# EAGLE design LTSN (EAGLE 9.6.2)
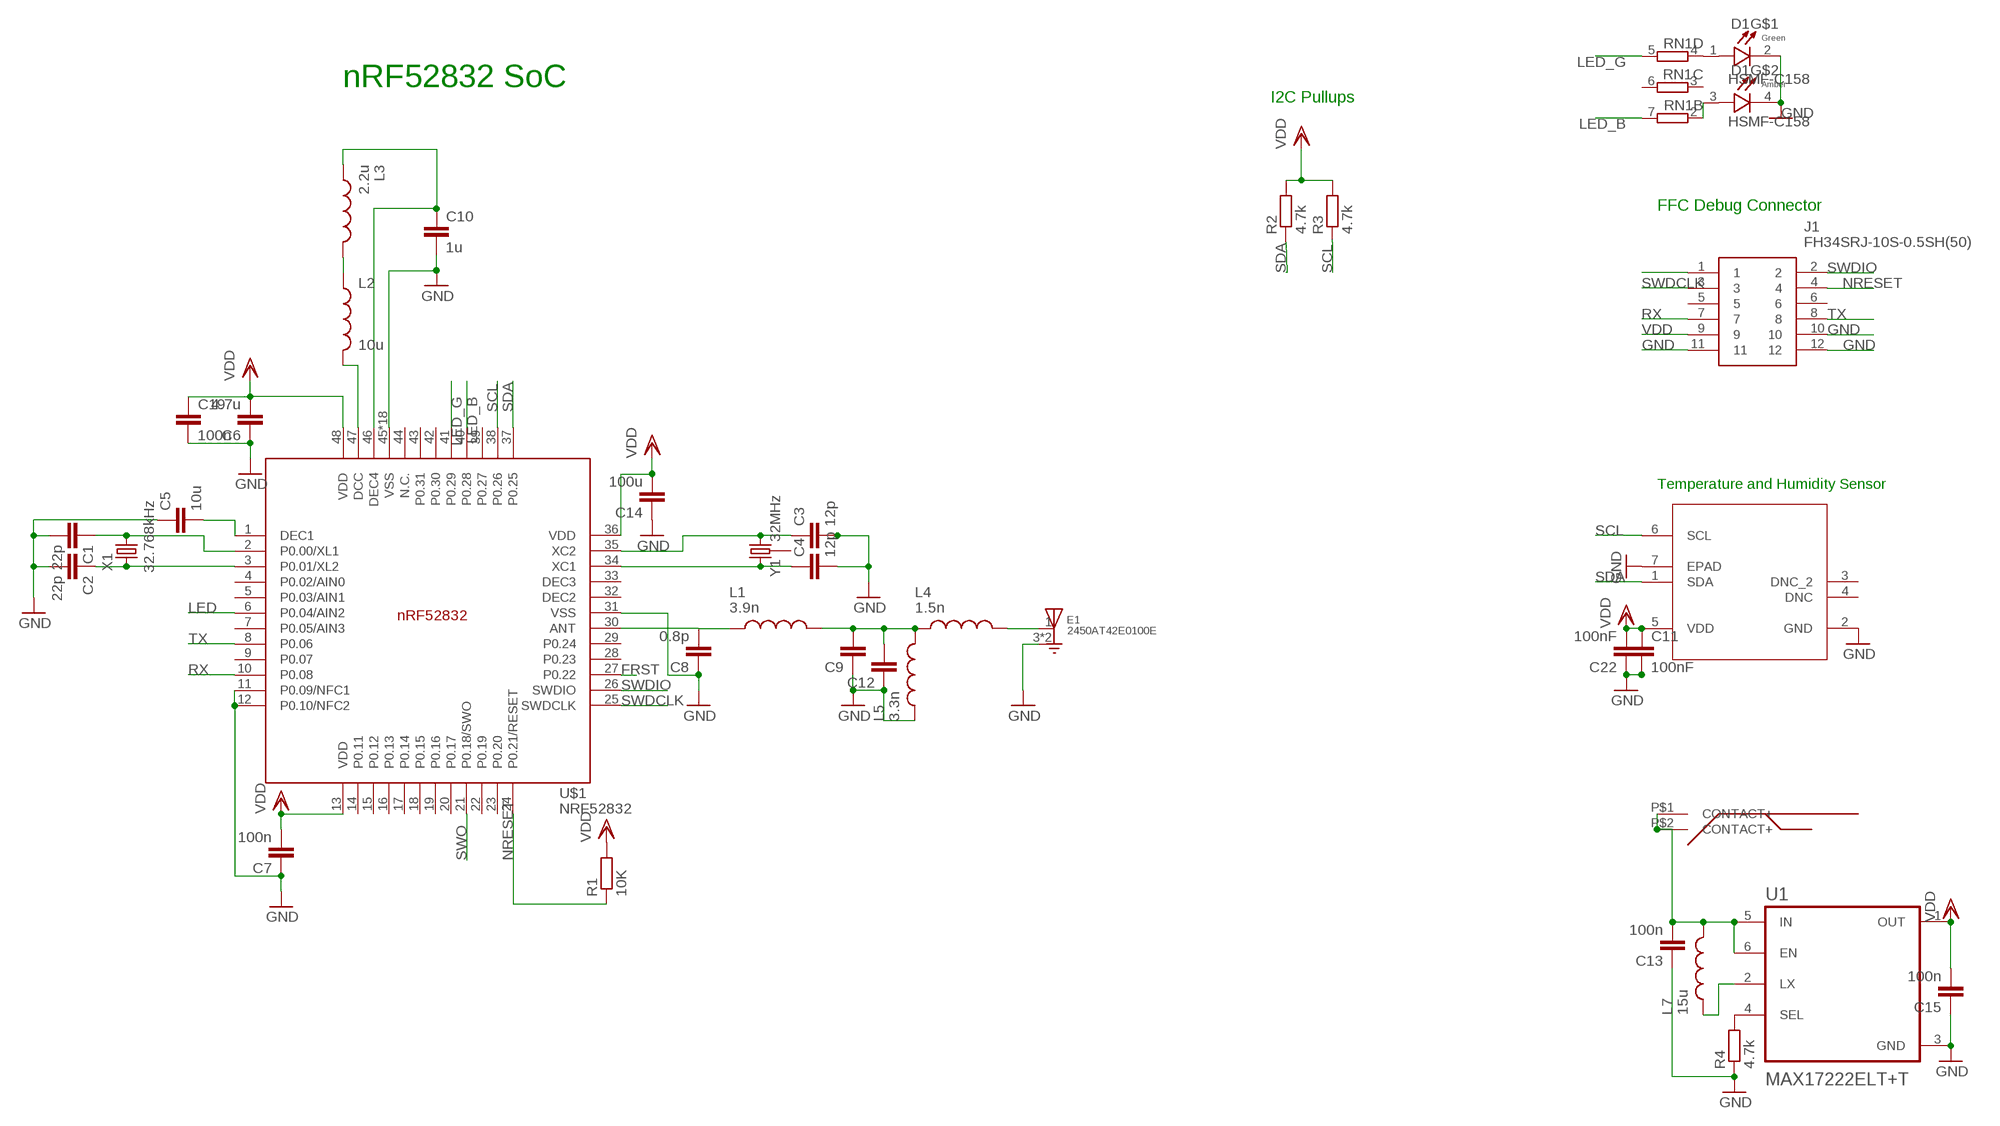
[diagram p0: schematic, sheet 1]

## Parts
C1  22p  CC0402  [C0402]
C2  22p  CC0402  [C0402]
C3  12p  CC0402  [C0402]
C4  12p  CC0402  [C0402]
C5  10u  CC0402  [C0402]
C6  4.7u  CC0402  [C0402]
C7  100n  CC0603R  [C0603R]
C8  0.8p  CC0402  [C0402]
C9  1.2p  CC0402  [C0402]
C10  1u  CC0402  [C0402]
C11  100nF  CC0402  [C0402]
C12  2p  CC0402  [C0402]
C13  100n  CC0603R  [C0603R]
C14  100u  CC0402  [C0402]
C15  100n  CC0603R  [C0603R]
C19  100n  CC0402  [C0402]
C22  100nF  CC0402  [C0402]
D1  HSMF-C158  [LED_HSMF-C158]
E1  2450AT42E0100E  [XDCR_2450AT42E0100E]
J1  FH34SRJ-10S-0.5SH(50)  [FH34SRJ10S05SH50]
L1  3.9n  MHQ0402P7N5JT000  [INDC0402X26N]
L2  10u  INDUCTOR  [L0603]
L3  2.2u  MHQ0402P7N5JT000  [INDC0402X26N]
L4  1.5n  MHQ0402P7N5JT000  [INDC0402X26N]
L5  3.3n  MHQ0402P7N5JT000  [INDC0402X26N]
L7  15u  1277AS-H-1R5M=P2  [INDC3225X120N]
R1  10K  RR0402  [R0402]
R2  4.7k  RR0402  [R0402]
R3  4.7k  RR0402  [R0402]
R4  4.7k  RR0402  [R0402]
RN1  4R-N0402ARV341  [4X0402ARV341]
U1  MAX17222ELT+T  [SON65P200X200X80-6N]
U10  SI7021-A20-GM1RDFN6_3X3_SIL-L  [DFN6_3X3_SIL-L]
U$1  NRF52832  [QFN40P600X600X90-48_N]
U$3  CR2032-THT  [CR2032-THT]
X1  32.768kHz  ABS07-32.768KHZ-T  [ABS07-32.768KHZ-T]
Y1  32MHz  CRYSTAL-26MHZSMD-3.2X2.5  [CRYSTAL-SMD-3.2X2.5MM]

## Nets
FRST: U$1.27(P0.22)
GND: C1.2 C2.2 C3.2 C4.2 C5.1 C6.1 C7.1 C8.1 C9.1 C10.2 C11.2 C12.1 C13.1 C14.1 C15.1 C19.2 C22.1 D1.2(C1) D1.4(C2) E1.3(GND) E1.4(GND) J1.10 J1.11 J1.12 L5.1 R4.1 U1.3(GND) U10.2(GND) U10.7(EPAD) U$1.11(P0.09/NFC1) U$1.12(P0.10/NFC2) U$1.31(VSS) U$1.45(VSS) U$1.PAD(VSS) U$1.PAD@VIA01(VSS) U$1.PAD@VIA02(VSS) U$1.PAD@VIA03(VSS) U$1.PAD@VIA04(VSS) U$1.PAD@VIA05(VSS) U$1.PAD@VIA06(VSS) U$1.PAD@VIA07(VSS) U$1.PAD@VIA08(VSS) U$1.PAD@VIA09(VSS) U$1.PAD@VIA10(VSS) U$1.PAD@VIA11(VSS) U$1.PAD@VIA12(VSS) U$1.PAD@VIA13(VSS) U$1.PAD@VIA14(VSS) U$1.PAD@VIA15(VSS) U$1.PAD@VIA16(VSS)
LED: U$1.6(P0.04/AIN2)
LED_B: RN1.7 U$1.40(P0.28)
LED_G: RN1.5 U$1.41(P0.29)
N$1: C1.1 U$1.2(P0.00/XL1) X1.2
N$2: C2.1 U$1.3(P0.01/XL2) X1.1
N$3: C3.1 U$1.35(XC2) Y1.3
N$4: C4.1 U$1.34(XC1) Y1.1
N$5: C5.2 U$1.1(DEC1)
N$6: C8.2 L1.1 U$1.30(ANT)
N$7: D1.1(A1) RN1.4
N$8: D1.3(A2) RN1.2
N$9: L2.2 U$1.47(DCC)
N$10: L2.1 L3.2
N$11: C10.1 L3.1 U$1.46(DEC4)
N$12: R4.2 U1.4(SEL)
N$13: E1.1(FEEDING) L4.2
N$15: C13.2 L7.2 U1.5(IN) U1.6(EN) U$3.P$1(CONTACT+) U$3.P$2(CONTACT+)
N$16: L7.1 U1.2(LX)
N$17: J1.1
NRESET: J1.4 R1.1 U$1.24(P0.21/RESET)
RF: C9.2 C12.2 L1.2 L4.1 L5.2
RX: J1.7 U$1.10(P0.08)
SCL: R3.1 U10.6(SCL) U$1.38(P0.26)
SDA: R2.1 U10.1(SDA) U$1.37(P0.25)
SWDCLK: J1.3 U$1.25(SWDCLK)
SWDIO: J1.2 U$1.26(SWDIO)
SWO: U$1.21(P0.18/SWO)
TX: J1.8 U$1.8(P0.06)
VDD: C6.2 C7.2 C11.1 C14.2 C15.2 C19.1 C22.2 J1.9 R1.2 R2.2 R3.2 U1.1(OUT) U10.5(VDD) U$1.13(VDD) U$1.36(VDD) U$1.48(VDD)
Unconnected: J1.5 J1.6 RN1.1 RN1.3 RN1.6 RN1.8 U10.3(DNC_2) U10.4(DNC) U$1.4(P0.02/AIN0) U$1.5(P0.03/AIN1) U$1.7(P0.05/AIN3) U$1.9(P0.07) U$1.14(P0.11) U$1.15(P0.12) U$1.16(P0.13) U$1.17(P0.14) U$1.18(P0.15) U$1.19(P0.16) U$1.20(P0.17) U$1.22(P0.19) U$1.23(P0.20) U$1.28(P0.23) U$1.29(P0.24) U$1.32(DEC2) U$1.33(DEC3) U$1.39(P0.27) U$1.42(P0.30) U$1.43(P0.31) U$1.44(N.C.) Y1.2 Y1.4

## Notes on the sheet
- nRF52832 SoC
- I2C Pullups
- FFC Debug Connector
- Temperature and Humidity Sensor

## Library data of the parts
C1-C6 C8-C12 C14 C19 C22 = eagle-ltspice:C: CAPACITOR, European symbol; SPICEMODEL: NONE; SPICEPREFIX: C
C7 C13 C15 = eagle-ltspice:C: CAPACITOR, European symbol
D1 = HSMF-C158:HSMF-C158: Amber, Green 592nm Amber, 572nm Green LED Indication - Discrete 1.9V Amber, 2.1V Green 1210 (3225 Metric) Check prices <https://pricing.snapeda.com/parts/HSMF-C158/Broadcom/view-part?ref=eda>; AVAILABILITY: In Stock; DESCRIPTION: Amber, Green 592nm Amber, 572nm Green LED Indication - Discrete 1.9V Amber, 2.1V Green 1210 (3225 Metric); MF: Broadcom; MP: HSMF-C158; PACKAGE: HSMF-C15 Broadcom; PRICE: None; PURCHASE-URL: https://pricing.snapeda.com/search/part/HSMF-C158/?ref=eda
E1 = 2450AT42E0100E:2450AT42E0100E: 2.4GHz Bluetooth, WLAN, Zigbee™ Chip RF Antenna 2.4GHz ~ 2.48GHz -2dBi Solder Surface Mount Check prices <https://pricing.snapeda.com/parts/2450AT42E0100E/Johanson%20Technology/view-part?ref=eda>; AVAILABILITY: In Stock; DESCRIPTION: 2.4GHz Bluetooth, WLAN, Zigbee™ Chip RF Antenna 2.4GHz ~ 2.48GHz -2dBi Solder Surface Mount; MF: Johanson Technology; MP: 2450AT42E0100E; PACKAGE: FBGA-780 Johanson Technology; PRICE: None; PURCHASE-URL: https://pricing.snapeda.com/search/part/2450AT42E0100E/?ref=eda
J1 = FH34SRJ-10S-0.5SH_50_:FH34SRJ-10S-0.5SH(50): HIROSE(HRS) - FH34SRJ-10S-0.5SH(50) - CONNECTOR, FFC/FPC, RCPT, 10POS, 1ROW Source: Datasheet <https://www.hirose.com/product/en/products/FH34SRJ/FH34SRJ-10S-0.5SH(50)/> Check prices <https://pricing.snapeda.com/search/part/FH34SRJ-10S-0.5SH%2850%29/?ref=eda>; AVAILABILITY: Good; DESCRIPTION: FFC & FPC Connectors 10POS 0.50MM R/A CONN FFC FPC; MF: Hirose Connector; MP: FH34SRJ-10S-0.5SH(50); PACKAGE: None; PRICE: None; PURCHASE-URL: https://pricing.snapeda.com/search/part/FH34SRJ-10S-0.5SH(50)/?ref=eda
L1 L3-L5 = MHQ0402P7N5JT000:MHQ0402P7N5JT000: 221 NH 5% GOLD TERMINAL; AVAILABILITY: Unavailable; DESCRIPTION: FIXED IND 7.5NH 200MA 1.2 OHM; MF: TDK; MP: MHQ0402P7N5JT000; PACKAGE: 0402 TDK; PRICE: None
L2 = BeagleBone_Blue_R3:INDUCTOR: Inductors Basic Inductor/Choke - 0603 and 1206. Footprints are not proven and vary greatly between part numbers. SRN6045- 33uH, 20% 1.4A
L7 = 1277AS-H-1R5M_P2:1277AS-H-1R5M=P2: Ind Metal Alloy Shielded 1.5uH 20% 1MHz Powdered Iron 2.6A 1210 T/R Check prices <https://pricing.snapeda.com/parts/1277AS-H-1R5M%3DP2/Murata/view-part?ref=eda>; AVAILABILITY: Warning; DESCRIPTION: Inductor with Inductance: 1.5uH Tol. +/-20%, Package: 1210 (3225); MF: Murata; MP: 1277AS-H-1R5M=P2; PACKAGE: 1210 Murata; PRICE: None; PURCHASE-URL: https://pricing.snapeda.com/search/part/1277AS-H-1R5M=P2/?ref=eda
R1-R4 = eagle-ltspice:R: RESISTOR, European symbol; SPICEMODEL: NONE; SPICEPREFIX: R
RN1 = resistor-dil:4R-N: Array Chip Resistor Source: RS Component / Phycomp; OC_FARNELL: unknown; OC_NEWARK: unknown
U1 = MAX17222ELT_T:MAX17222ELT+T: Check prices <https://pricing.snapeda.com/parts/MAX17222ELT%2B/Maxim%20Integrated/view-part?ref=eda>; AVAILABILITY: In Stock; DESCRIPTION: Boost Switching Regulator IC Positive Adjustable 1.8V 1 Output 500mA (Switch) 6-WDFN; MF: Maxim Integrated; MP: MAX17222ELT+; PACKAGE: uDFN-6 Maxim; PRICE: None
U10 = SI7021:SI7021-A20-GM1R; BUILT_BY: EMA_Jessica; COPYRIGHT: Copyright (C) 2018 Accelerated Designs. All rights reserved; MANUFACTURER_PART_NUMBER: SI7021-A20-GM1R; SOURCELIBRARY: Silicon_Labs_2020-01-01; VENDOR: Silicon Labs
U$1 = Nordic_nRF:NRF52832: nRF52832 Features Single chip, highly flexible, 2.4 GHz multi-protocol SoC 32-bit ARM Cortex-M4F Processor 1.7v to 3.6v operation 512kB flash + 64kB RAM Supports concurrent Bluetooth Smart/ANT protocol operation On-chip NFC tag for Out-of-Band (OOB) pairing Up to +4dBm output power -96dBm sensitivity, Bluetooth Smart Thread safe and run-time protected Event driven API On air compatible with nRF24L and nRF24AP series 2 data rates (2Mbps/1Mbps) PPI - maximum flexibility for power-efficient applications and code simplification Automated power management system with automatic power management of each peripheral Configurable I/O mapping for analog and digital I/O 3 x Master/Slave SPI 2 x Two-wire interface (I²C) UART (RTS/CTS) 3 x PWM AES HW encryption Real Time Counter (RTC) Digital microphone interface (PDM) On-chip balun Applications Internet of Things (IoT) Wearables SmartHome sensors Connected white goods Computer peripherals Voice-command smart remotes A4WP ‘Rezence’ wireless charging Beacons Sports and fitness sensors and hubs Connected health products Smart watches RC Toys Interactive games Building automation and sensor networks
U$3 = cr2032-tht:CR2032-THT
X1 = Crystals:ABS07-32.768KHZ-T: CRYSTAL 32.7680KHZ 12.5PF SMD Manufacturer's datasheet <https://abracon.com/Resonators/ABS07.pdf>; CREATED_BY: PCBLayout.com; DIGIKEY_PART_NUMBER: 535-9542-2-ND; MANUFACTURER: Abracon LLC; MPN: ABS07-32.768KHZ-T; PACKAGE: SMD-2
Y1 = SparkFun-Clocks:CRYSTAL-26MHZ: 26MHz Crystal w/ Ground Pin Digikey Example <http://www.digikey.com/product-detail/en/epson/TSX-3225%2026.0000MF09Z-AC3/SER3627CT-ND/1802878> Frequency: 26MHz Frequency Stability: ±9ppm Frequency Tolerance: ±10ppm Load Capacitance: 9pF SparkFun Products: SparkFun ESP32 Thing <https://www.sparkfun.com/products/13907> SparkFun ESP8266 Thing Dev Board <https://www.sparkfun.com/products/13711>; PROD_ID: XTAL-12454

## Board
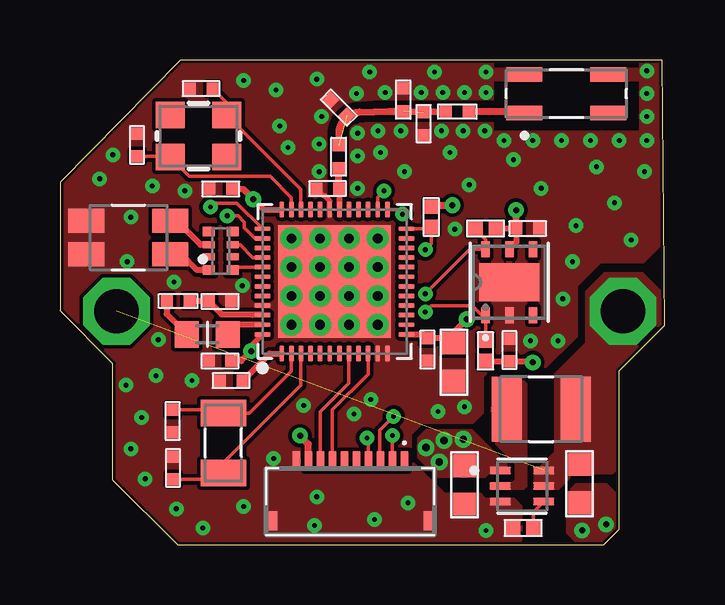
[diagram p1: board, top side]
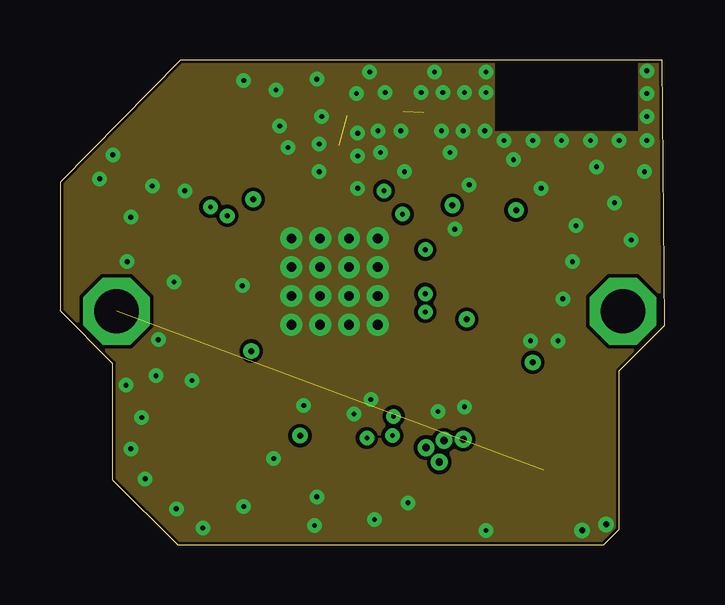
[diagram p2: board, inner layer GND]
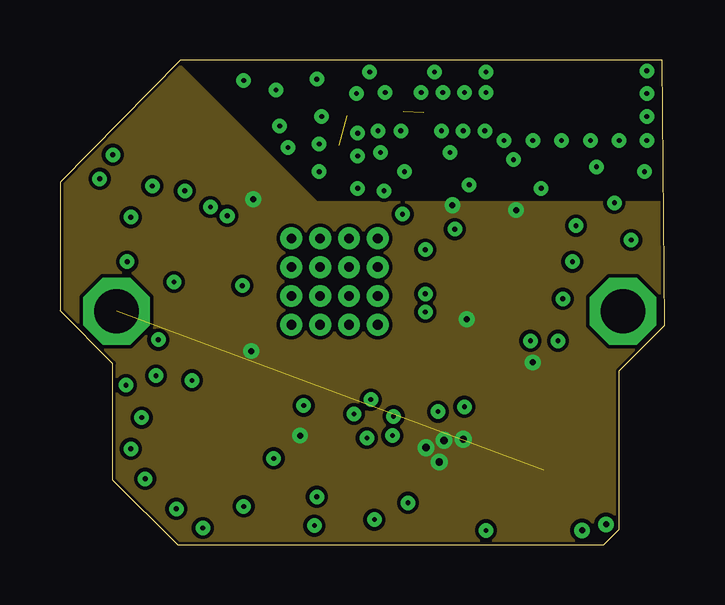
[diagram p3: board, inner layer VDD]
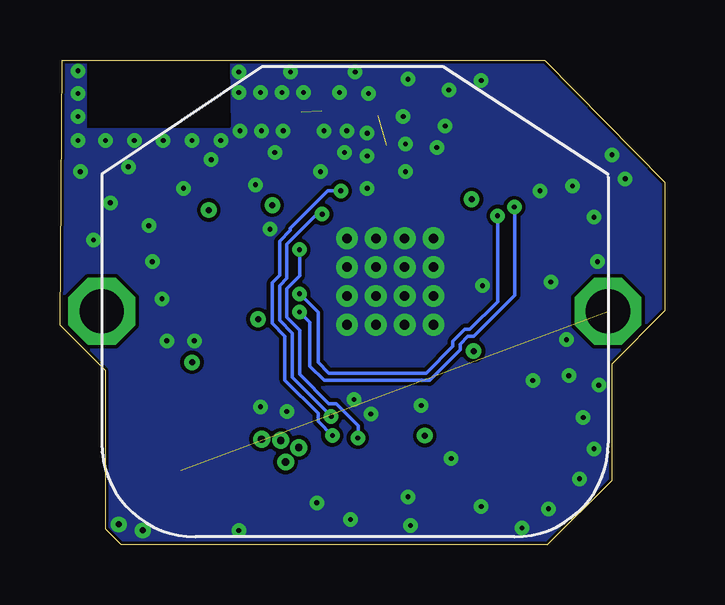
[diagram p4: board, bottom side, seen from below]

Size 25.2 x 20.2 mm. Coordinates in mm from the lower left corner, seen from the top.
Outline: 4.9,0 22.65,0 23.3,0.65 23.3,7.25 25.2,9.15 25.1,20.2 5,20.2 0,15.1 0,9.75 2.2,7.55 2.2,2.7 4.9,0
Copper layers (1+2*15+16): Top 0.035mm / dielectric 0.5mm / GND 0.035mm / dielectric 0.15mm / VDD 0.035mm / dielectric 0.2mm / Bottom 0.035mm
Design rules "default *": minimum track width 5mil, minimum drill 0.2mm, track to track 6mil, track to pad 6mil, pad to pad 6mil, via to via 6mil, smd to smd 6mil, copper to edge 5mil, drill to drill 6mil, minimum pad ring 10mil, minimum via ring 8mil, stop-mask expansion 0mil, vias tented up to drill 40mil, thermal gap 0mil
tRestrict: area 4,15.6 to 7.6,18.4; area 5.8,2.4 to 7.8,6; 8 lines

### Footprints (pad centres in the part's own frame; a part is rotated, then mirrored left to right if it is on the bottom)
C0402 = smd 0.5 x 0.5: 1 -0.475,0; 2 0.475,0
C0603R = smd 0.95 x 0.95: 1 -0.85,0; 2 0.75,0
LED_HSMF-C158 = smd 1.5 x 1: 1 -1.75,0.7; 2 1.75,0.7; 3 -1.75,-0.7; 4 1.75,-0.7
XDCR_2450AT42E0100E = smd 1.5 x 0.6: 1 1.75,0.8; 2 -1.75,0.8; 3 -1.75,-0.8; 4 1.75,-0.8
FH34SRJ10S05SH50 = smd 0.3 x 0.8: 1 2.25,1.55; 2 1.75,1.55; 3 1.25,1.55; 4 0.75,1.55; 5 0.25,1.55; 6 -0.25,1.55; 7 -0.75,1.55; 8 -1.25,1.55; 9 -1.75,1.55; 10 -2.25,1.55 | smd 0.4 x 0.8: 11 -3.25,-0.95; 12 3.25,-0.95
INDC0402X26N = smd 0.5 x 0.5: 1 -0.732,0; 2 0.232,0
L0603 = smd 1 x 1.1: 1 -0.85,0; 2 0.85,0
INDC3225X120N = smd 1.24 x 2.72: 1 -1.44,0; 2 1.44,0
R0402 = smd 0.6 x 0.55: 1 -0.425,0; 2 0.425,0
4X0402ARV341 = smd 0.4 x 0.5: 1 -0.8,-0.5; 4 0.8,-0.5; 5 0.8,0.5; 8 -0.8,0.5 | smd 0.3 x 0.5: 2 -0.25,-0.5; 3 0.25,-0.5; 6 0.25,0.5; 7 -0.25,0.5
SON65P200X200X80-6N = smd 0.88 x 0.32: 1 -0.91,0.65; 2 -0.91,0; 3 -0.91,-0.65; 4 0.91,-0.65; 5 0.91,0; 6 0.91,0.65
DFN6_3X3_SIL-L = smd 0.66 x 0.356: 1 -1.372,0.991; 2 -1.372,0; 3 -1.372,-0.991; 4 1.372,-0.991; 5 1.372,0; 6 1.372,0.991 | smd 1.6 x 2.489: 7 0,0
QFN40P600X600X90-48_N = smd 0.65 x 0.2: 1 -3,2.2; 2 -3,1.8; 3 -3,1.4; 4 -3,1; 5 -3,0.6; 6 -3,0.2; 7 -3,-0.2; 8 -3,-0.6; 9 -3,-1; 10 -3,-1.4; 11 -3,-1.8; 12 -3,-2.2; 25 3,-2.2; 26 3,-1.8; 27 3,-1.4; 28 3,-1; 29 3,-0.6; 30 3,-0.2; 31 3,0.2; 32 3,0.6; 33 3,1; 34 3,1.4; 35 3,1.8; 36 3,2.2 | smd 0.2 x 0.65: 13 -2.2,-3; 14 -1.8,-3; 15 -1.4,-3; 16 -1,-3; 17 -0.6,-3; 18 -0.2,-3; 19 0.2,-3; 20 0.6,-3; 21 1,-3; 22 1.4,-3; 23 1.8,-3; 24 2.2,-3; 37 2.2,3; 38 1.8,3; 39 1.4,3; 40 1,3; 41 0.6,3; 42 0.2,3; 43 -0.2,3; 44 -0.6,3; 45 -1,3; 46 -1.4,3; 47 -1.8,3; 48 -2.2,3 | smd 4.7 x 4.7: PAD 0,0 | drill 0.4: PAD@VIA01 -1.8,1.8; PAD@VIA02 -1.8,0.6; PAD@VIA03 -1.8,-0.6; PAD@VIA04 -1.8,-1.8; PAD@VIA05 -0.6,1.8; PAD@VIA06 -0.6,0.6; PAD@VIA07 -0.6,-0.6; PAD@VIA08 -0.6,-1.8; PAD@VIA09 0.6,1.8; PAD@VIA10 0.6,0.6; PAD@VIA11 0.6,-0.6; PAD@VIA12 0.6,-1.8; PAD@VIA13 1.8,1.8; PAD@VIA14 1.8,0.6; PAD@VIA15 1.8,-0.6; PAD@VIA16 1.8,-1.8
CR2032-THT = drill 1.85 octagon: P$1 0,0; P$2 21.1,0
ABS07-32.768KHZ-T = smd 1.1 x 1.9: 1 -1.25,0; 2 1.25,0
CRYSTAL-SMD-3.2X2.5MM = smd 1.2 x 1.1: 1 -1.175,-0.875; 2 1.175,-0.875; 3 1.175,0.875; 4 -1.175,0.875

### Placement (x,y rotation side)
C1  4.69,5.16 270 top
C2  4.71,3.2 90 top
C3  3.21,16.66 90 top
C4  5.88,19.01 180 top
C5  7.13,6.84 0 top
C6  15.31,8.14 90 top
C7  16.41,7.66 90 top
C8  11.15,14.84 0 top
C9  11.62,18.21 315 top
C10  6.67,10.14 0 top
C11  6.67,7.66 180 top
C12  15.15,17.55 90 top
C13  21.65,2.6 90 top
C14  18.73,8.12 270 top
C15  16.85,2.55 90 top
C19  19.49,13.18 0 top
C22  6.7,14.83 0 top
D1  2.85,12.8 180 top
E1  21.1,18.8 180 top
J1  12.1,1.95 0 top
L1  11.61,16.42 90 top
L2  6.14,8.77 0 top
L3  4.67,10.16 180 top
L4  16.8,18.05 0 top
L5  14.3,18.3 270 top
L7  20.05,5.65 0 top
R1  15.47,13.66 90 top
R2  17.73,8.08 270 top
R3  17.73,13.18 0 top
R4  19.3,0.7 0 top
RN1  6.7,12.25 270 top
U1  19.25,2.45 0 top
U10  18.72,10.94 90 top
U$1  11.44,10.97 90 top
U$3  23.46,9.73 180 top
X1  6.81,4.24 90 top
Y1  5.77,17.03 180 top

### Tracks (layer width: path | path; a pad name or v marks a point on that pad's centre or on a via)
GND  (via drill 0.2, 0.25)
  Top 0.127: U$1.PAD U$1.PAD@VIA11
  Top 0.2: C8.1 10.97,14.55 11.03,14.55 11.24,14.33 U$1.31
  other vias: 22.75,0.85 21.75,0.6 22.1,16.85 20.9,16.85 16.8,17.25 19.7,16.85 18.5,16.85 15.9,17.25 17.7,17.25 14.35,15.55 17.05,15 16.25,16.35 20.95,10.25 21.35,11.8 18.9,16.05 13.55,18.85 12.4,17.15 10.9,17.85 12.4,16.2 12.4,14.85 10.8,16.7 21.5,13.3 20.05,14.85 24.35,15.55 22.35,15.75 23.8,12.7 20.75,8.5 10.8,15.55 24.45,17.85 24.45,16.85 24.45,18.8 24.45,19.75 23.3,16.85 17.75,18.85 14.2,17.25 16.45,13.15 16.85,5.75 13.35,16.35 19.6,8.5 16.85,18.85 17.75,19.7 15.05,18.85 15.95,18.85 12.35,18.8 13.25,17.25 8.9,3.6 17.75,0.6 5.95,0.7 10.7,2 15.75,5.55 7.65,1.6 10.6,0.8 12.25,5.45 13.1,1.05 10.15,5.8 12.95,6.05 14.5,1.75 5.5,6.85 4,7.05 2.95,4 3.4,5.3 3.55,2.75 4.85,1.5 7.6,10.8 5.2,14.75 4.75,10.95 2.8,11.8 4.1,8.55 2.95,13.65 9.15,17.45 9.5,16.55 15.6,19.7 9,18.95 10.7,19.4 12.9,19.7 3.85,14.95 2.75,6.65 23.1,14.25 2.2,16.25 7.65,19.35 1.65,15.25
  pour Top: 18,20.2 18,17.2 24.2,17.2 24.2,20.2 25.2,20.2 25.2,12.7 24.3,11.8 22.5,11.8 21.5,10.8 21.5,8.7 20.1,7.3 17.9,7.3 17.6,7 17.6,5.5 17.2,5.1 15.1,5.1 14.6,4.6 14.6,3.5 16,2.1 17.5,2.1 17.7,1.9 18.9,1.9 19.2,1.6 19.2,0.2 0.1,0.2 0,0.1 0,20.2
  pour Top: 18.73,19.82 18.02,19.82 18.02,19.38 18.73,19.38
  pour Bottom: 0.05,20.2 15.2,20.2 18.1,17.3 24.15,17.3 24.15,20.2 25.25,20.2 25.25,0.05 0.05,0.05
  pour Top: 21.15,0.5 21.15,2.15 21.5,2.5 22,2.5 22.75,2.5 23.25,2 23.25,0.75 22.75,0.25 22.65,0.15 21.5,0.15
  pour Top: 24.25,19.82 23.55,19.82 23.55,19.38 24.25,19.38
  pour GND: 18,20.2 18,17.15 24.2,17.15 24.2,20.15 25.15,20.15 25.15,0.3 23.55,-1.3 3.3,-1.3 -0.4,2.4 -0.4,14.65 5.15,20.2
  pour Bottom: 18.05,20.1 18.05,20.2 15.1,20.2 18,17.3
LED_B
  Top 0.15: RN1.7 7.5,12.5 8.03,11.97 U$1.40
LED_G
  Top 0.15: U$1.41 7.32,11.57 RN1.5
N$1
  Top 0.15: C1.1 6.67,5.63 X1.2 7.89,5.49 9.64,7.24 U$1.2
N$2
  Top 0.15: C2.1 6.03,2.73 6.29,2.99 X1.1 6.81,3.41 10.04,6.64 U$1.3
N$3
  Top 0.15: C3.1 4.55,16.18 | 4.55,16.18 4.57,16.18 Y1.3 | U$1.35 9.64,14.46 8.75,15.35 5.38,15.35 4.55,16.18
N$4
  Top 0.15: C4.1 6.95,18.42 Y1.1 10.04,14.81 U$1.34
N$5
  Top 0.254: C5.2 8.73,7.97 U$1.1
N$6
  Top 0.254: C8.2 11.64,14.82 U$1.30
  Top 0.3: C8.2 11.61,14.85 L1.1
N$7
  Top 0.254: RN1.4 5.7,11.45 5.05,12.1 D1.1
N$8
  Top 0.254: RN1.2 5.86,12.5 4.86,13.5 D1.3
N$9
  Top 0.254: U$1.47 7.39,9.17 L2.2
N$10
  Top 0.254: L3.2 4.44,9.62 L2.1
N$11
  Top 0.15: U$1.46
  Top 0.254: U$1.46 8.03,9.58 8.01,9.6 6.74,9.6 C10.1 5.42,10.14 L3.1
N$12
  Top 0.15: R4.2 19.73,1.36 U1.4
N$13
  Top 0.3: E1.1 19.3,18.05 L4.2
N$15  (1 unrouted)
  pour Top: 19.8,3 20.65,3.85 20.65,7.1 21.95,8.4 21.95,10.55 22.7,11.3 24.25,11.3 25.05,10.5 25.05,5.05 23,3 21.4,3 20.75,2.35 19.8,2.35
N$16
  pour Top: 17.95,2.55 18.85,2.55 19,2.7 19,3.4 18,4.4 18,6.9 19.2,6.9 19.4,6.7 19.4,2.45 19.3,2.35 17.95,2.35
NRESET  (via drill 0.2)
  Top 0.15: J1.4 12.85,4.39 v12.79,4.45 | v15.22,12.3 15.47,12.55 15.47,13.15 | 15.47,13.15 R1.1 | U$1.24 15.45,13.17 15.47,13.15
  Bottom 0.15: v12.79,4.45 12.77,4.47 12.77,4.97 13.68,5.88 14,5.88 15.22,7.1 15.22,8.95 15.75,9.48 15.75,10.68 15.22,11.21 v15.22,12.3
RF  (2 unrouted)
  Top 0.3: L1.2 11.62,17.18 arc-87 12.47,18.02 arc-1 L5.2 L4.1
RX
  Top 0.15: J1.7 11.35,5.62 12.84,7.11 U$1.10
SCL  (via drill 0.2)
  Top 0.15: v15.22,10.46 17.07,12.31 U10.6 17.73,12.71 17.3,13.13 R3.1 | U$1.38 8.11,12.77 7.68,13.2 7.68,13.45 7.42,13.71 v6.97,13.71
  Bottom 0.15: v6.97,13.71 6.97,10.13 8.12,8.98 8.33,8.98 8.83,8.48 8.83,8.27 9.95,7.15 14,7.15 14.45,7.6 14.45,9.69 v15.22,10.46
SDA  (via drill 0.2)
  Top 0.15: v6.27,14.08 6.27,14.1 6.4,14.24 7.37,14.24 U$1.37 | v15.22,9.7 15.48,9.96 17.18,9.96 17.57,9.57 U10.1 R2.1
  Bottom 0.15: v15.22,9.7 14.8,9.28 14.8,7.45 14.2,6.85 9.8,6.85 8.53,8.12 8.53,8.35 8.2,8.68 7.97,8.68 6.25,10.4 6.25,14.06 v6.27,14.08
SWDCLK  (via drill 0.2)
  Top 0.15: U$1.25 14.08,13.97 v14.28,13.77 | J1.3 13.32,3.53 13.32,4.77 v13.9,5.35
  Bottom 0.15: v14.28,13.77 14.5,13.77 15.75,12.52 15.75,11.11 16.05,10.8 16.05,9.35 15.52,8.82 15.52,6.97 v13.9,5.35
SWDIO  (via drill 0.2)
  Top 0.15: J1.2 v13.85,4.55 | v13.5,14.75 13.24,14.49 U$1.26
  Bottom 0.15: v13.85,4.55 14.45,5.15 14.45,5.47 15.82,6.85 15.82,8.7 16.36,9.23 16.36,10.93 16.05,11.23 16.05,12.64 15.6,13.1 15.6,13.2 14.05,14.75 v13.5,14.75
TX
  Top 0.15: J1.8 10.85,5.55 12.04,6.74 U$1.8
VDD  (via drill 0.25, 0.3)
  Top 0.203: U$1.48 7.97,8.3 v7.97,8.07
  Top 0.254: U$1.13 15.15,8.77 C6.2 16.2,8.61 C7.2 16.41,8.86 v16.95,9.4 | R2.2 C14.2 19.66,7.65 v19.7,7.6 | U10.5 19.02,12.61 C19.1 R3.2 | 7.64,14.83 8.5,13.97 U$1.36 | C22.2 7.64,14.83 | 7.64,14.83 7.64,14.81 v8.05,14.4 | C11.1 7.56,7.66 v7.97,8.07
  Top 0.3: J1.9 10.35,4.2 v10,4.55 | C19.1 19.02,13.93 v19,13.95 | R1.2 15.54,14.15 v16.35,14.15
  other vias: 16.8,4.4 16,4.35 15.25,4.05 15.8,3.45
  pour Top: 15.75,2.85 17.7,2.85 17.85,3 18.65,3 18.65,3.25 17.15,4.75 15.25,4.75 14.95,4.45 14.95,3.65
  pour VDD: 0,20.2 4.75,20.2 10.7,14.25 25.2,14.25 25.2,0.05 0,0.05